# Altium schematic sheet HIM.SchDoc: IHM
size A4; Date: 04/19/2026; CheckedBy: Lanfroid-Nazac Guillaume; Author: Déronne Mathis; DrawnBy: Déronne Mathis; Revision: v1.1; SheetNumber: 4; SheetTotal: 7; ModifiedBy: Lanfroid-Nazac Guillaume
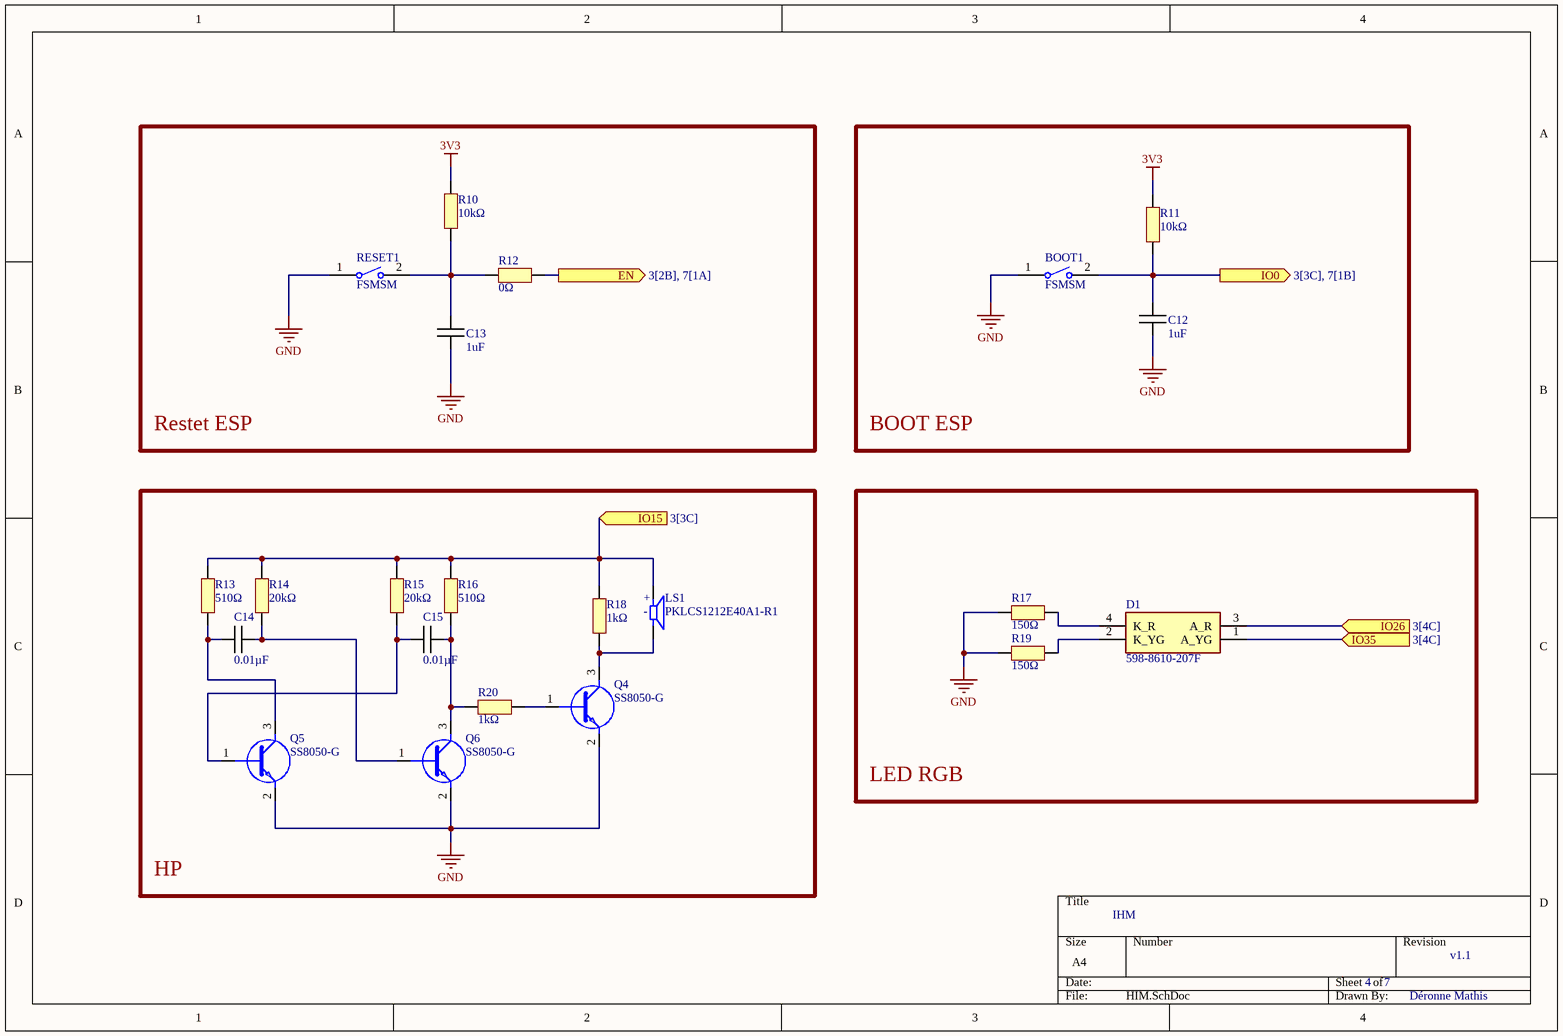
[diagram p0: HIM.SchDoc]

## Parts
BOOT1  FSMSM  [TECO-FSMSM-2_V]
C12  1uF  [CAPC1005X06N]
C13  1uF  [CAPC1005X06N]
C14  0.01µF  [CAPC1005X06N]
C15  0.01µF  [CAPC1005X06N]
D1  598-8610-207F  [5988610207F]
LS1  PKLCS1212E40A1-R1  [SPKR_PKLCS1212E40A1-R1]
Q4  SS8050-G  [SS8050-G]
Q5  SS8050-G  [SS8050-G]
Q6  SS8050-G  [SS8050-G]
R10  10kΩ  [RESC1005X06N]
R11  10kΩ  [RESC1005X06N]
R12  0Ω  [RESC1005X06N]
R13  510Ω  [RESC1005X06N]
R14  20kΩ  [RESC1005X06N]
R15  20kΩ  [RESC1005X06N]
R16  510Ω  [RESC1005X06N]
R17  150Ω  [RESC1005X06N]
R18  1kΩ  [RESC1005X06N]
R19  150Ω  [RESC1005X06N]
R20  1kΩ  [RESC1005X06N]
RESET1  FSMSM  [TECO-FSMSM-2_V]

## Blocks framed on the sheet
Restet ESP: C13 R10 R12 RESET1
BOOT ESP: BOOT1 C12 R11
HP: C14 C15 LS1 Q4-Q6 R13-R16 R18 R20
LED RGB: D1 R17 R19

## Ports
EN (out, see 3[2B], 7[1A]), IO0 (out, see 3[3C], 7[1B]), IO15 (in, see 3[3C]), IO26 (in, see 3[4C]), IO35 (in, see 3[4C])

## Nets
3V3: R10.2 R11.2
GND: BOOT1.1 C12.2 C13.2 Q4.2(E) Q5.2(E) Q6.2(E) R17.1 R19.1 RESET1.1
EN: R12.2 ; port EN
IO0: BOOT1.2 C12.1 R11.1 ; port IO0
IO15: LS1.P R13.2 R14.2 R15.2 R16.2 R18.2 ; port IO15
IO26: D1.3(A_R) ; port IO26
IO35: D1.1(A_YG) ; port IO35
NetC13_1: C13.1 R10.1 R12.1 RESET1.2
NetC14_1: C14.1 Q5.3(C) R13.1
NetC14_2: C14.2 Q6.1(B) R14.1
NetC15_1: C15.1 Q5.1(B) R15.1
NetC15_2: C15.2 Q6.3(C) R16.1 R20.1
NetD1_2: D1.2(K_YG) R19.2
NetD1_4: D1.4(K_R) R17.2
NetLS1_N: LS1.N Q4.3(C) R18.1
NetQ4_1: Q4.1(B) R20.2

## Notes on the sheet
- 4
- 7
- (in symbol PKLCS1212E40A1-R1) +; -

## Library data of the parts
BOOT1 RESET1 = CMP-2000-07511-1: FSMSM Push Button Switch, 50 mA, -35 to 85 degC, 2-Pin SMD, RoHS, Bulk; Manufacturer: TE Connectivity; Actuator Length: 1.07mm; Electrical Life: 20000Cycles; Actuator Material: Polyamide; Current Rating: 50mA; Illumination Type: Illuminated; Voltage Rating (DC): 24V; Contact Resistance: 100mOhm; Case\/Package: SMD/SMT; Operating Force: 180gf; Switch Travel: 0.25mm; Max Voltage Rating (DC): 12V; Throw Configuration: SPST; Packaging: LoosePiece; Max Operating Temperature: 85degC; ELV: Compliant; Package Description: 2-Pin Surface Mount Device, Body 6 x 3.5 mm, Pitch 9.19 mm; RoHSCompliant: true; Manufacturer URL: http://www.te.com/; Contact Plating: Silver; Contact Material: Brass; Mounting Technology: SurfaceMount; Contact Current Rating: 50mA; Datasheet Version: Rev. C2, 08/2014; Datasheet URL: http://www.te.com/commerce/DocumentDelivery/DDEController?Action=showdoc&DocId=Customer+Drawing%7F1437566-3%7FC2%7Fpdf%7FEnglish%7FENG_CD_1437566-3_C2_1437566_3_1_c.dwg.pdf%7F1437566-3; Mechanical Life: 20000Cycles; Package Reference: FSMSM; REACH SVHC: Unknown; Orientation: Straight; Min Operating Temperature: -35degC; Lead Free: LeadFree; Termination: GullWing; Package Quantity: 1000; Mount: SurfaceMount
C12-C15 = Capacitor
D1 = 598-8610-207F: Standard LEDs - SMD Red/Green WC 80/50mcd 645/570nm; Manufacturer_Name: Dialight; Geometry.Height: 0.8mm; Manufacturer_Part_Number: 598-8610-207F; Mouser Part Number: 645-598-8610-207F; Mouser Price/Stock: https://www.mouser.co.uk/ProductDetail/Dialight/598-8610-207F?qs=7JStj%2FjQ2SFuCjosqwklHQ%3D%3D; Arrow Part Number: 598-8610-207F; Arrow Price/Stock: https://www.arrow.com/en/products/598-8610-207f/dialight?region=nac; Datasheet Link: https://media.digikey.com/pdf/Data%20Sheets/Dialight%20PDFs/598%20Series%201210%20Pkg%20Bi-Color.pdf
LS1 = PKLCS1212E40A1-R1: Buzzers Transducer, Externally Driven Piezo 1.5V 2kHz 70dB @ 1.5V, 10cm Surface Mount Solder Pads; MF: Murata Electronics; Value: *; MP: PKLCS1212E40A1-R1; Package: None; Availability: Unavailable; Price: None
Q4-Q6 = SS8050-G: Bipolar Transistors - BJT NPN TRANSISTOR 1.5A 40V
R10-R20 = Resistor